# Altium schematic sheet SERIAL_INTERFACES.SchDoc: Carte mère embarquée - RS232 interface
size A3; Author: B Labbe; CompanyName: Oufffteam; DrawnBy: B Labbe; Engineer: B Labbe; Organization: Oufffteam; Address1: L3, 12a Rodborough Rd; Address2: Frenchs Forest; Address3: NSW; Address4: Australia 2086; Revision: A; SheetNumber: 6; SheetTotal: 6; DocumentName: Carte mère embarquée - RS232 interface
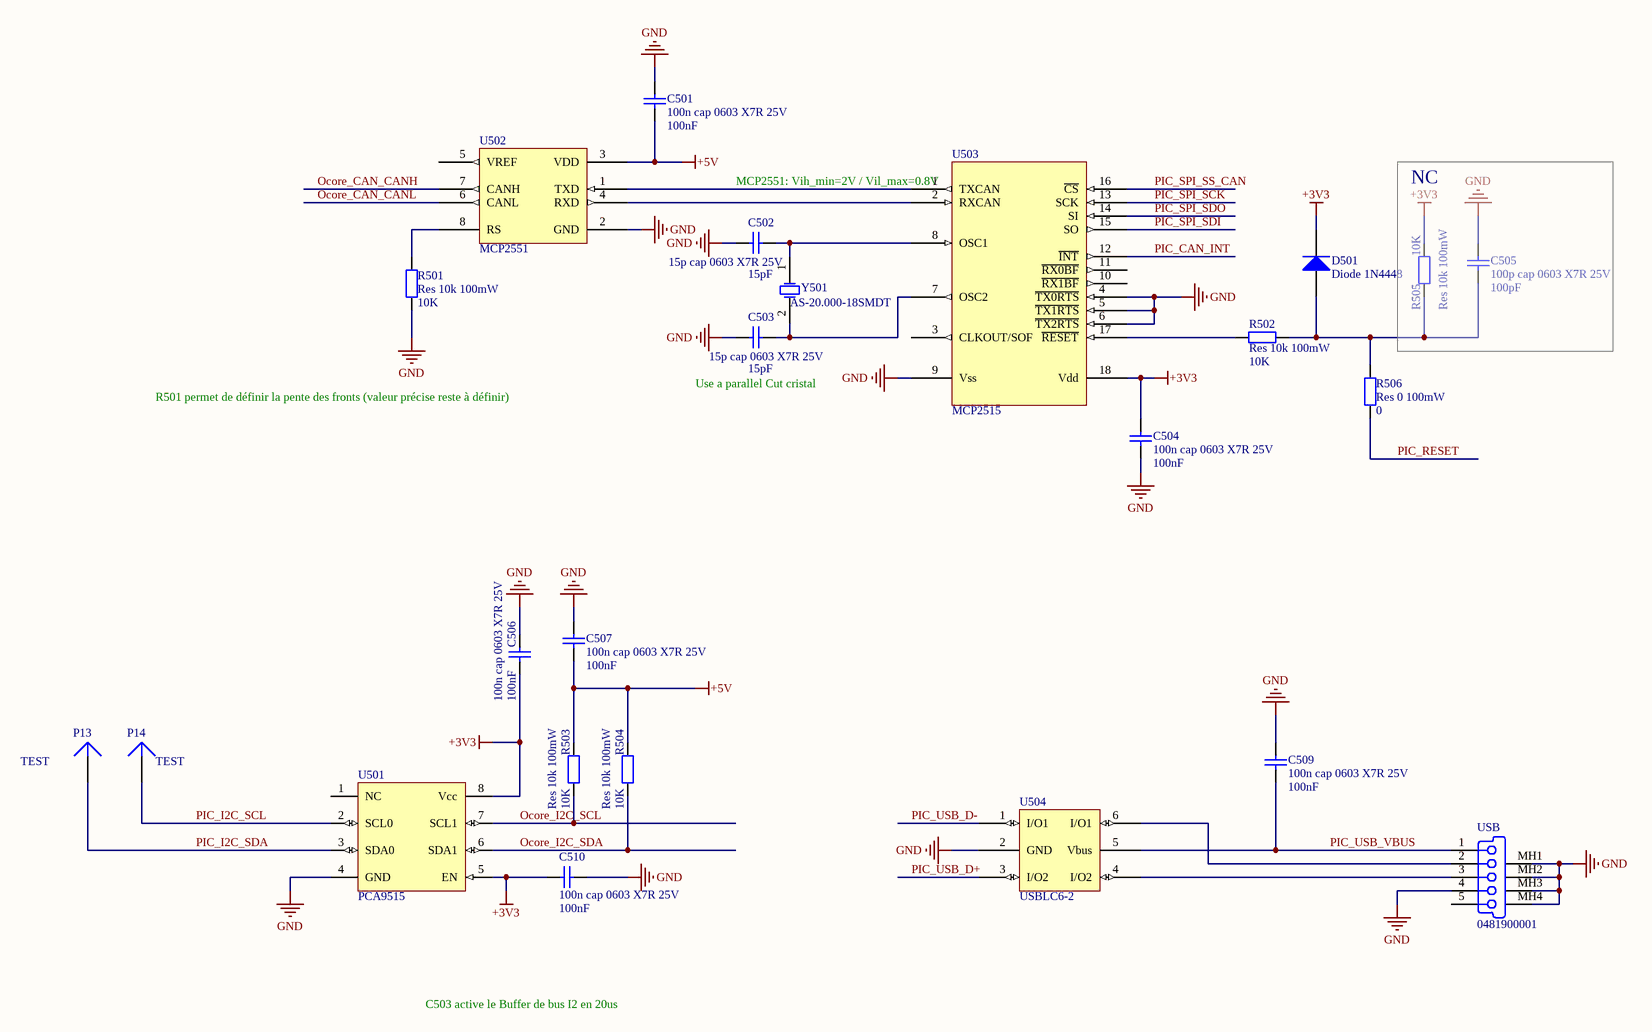
[diagram p0: SERIAL_INTERFACES.SchDoc]

## Parts
C501  100n cap 0603 X7R 25V  value 100nF  [1608[0603]]
C502  15p cap 0603 X7R 25V  value 15pF  [1608[0603]]
C503  15p cap 0603 X7R 25V  value 15pF  [1608[0603]]
C504  100n cap 0603 X7R 25V  value 100nF  [1608[0603]]
C505  100p cap 0603 X7R 25V  value 100pF  [1608[0603]]
C506  100n cap 0603 X7R 25V  value 100nF  [1608[0603]]
C507  100n cap 0603 X7R 25V  value 100nF  [1608[0603]]
C509  100n cap 0603 X7R 25V  value 100nF  [1608[0603]]
C510  100n cap 0603 X7R 25V  value 100nF  [1608[0603]]
D501  Diode 1N4448  [1608[0603]]
P13  TEST  [TP1]
P14  TEST  [TP1]
R501  Res 10k 100mW  value 10K  [1608[0603]]
R502  Res 10k 100mW  value 10K  [1608[0603]]
R503  Res 10k 100mW  value 10K  [1608[0603]]
R504  Res 10k 100mW  value 10K  [1608[0603]]
R505  Res 10k 100mW  value 10K  [1608[0603]]
R506  Res 0 100mW  value 0  [1608[0603]]
U501  PCA9515  [751-02_M]
U502  MCP2551  [SOIC150-8_N]
U503  MCP2515  [SOIC127P1030X265-18N]
U504  USBLC6-2  [SOT23-6]
USB  0481900001  [USB]
Y501  AS-20.000-18SMDT  [HC49/S]

## Blocks framed on the sheet
NC: C505 R505

## Nets
+3V3: C504.1 C506.1 C510.2 D501.2(K) R505.2 U501.5(EN) U501.8(Vcc) U503.18(Vdd)
+5V: C501.1 C507.2 R503.2 R504.2 U502.3(VDD)
GND: C501.2 C502.1 C503.1 C504.2 C505.2 C506.2 C507.1 C509.2 C510.1 R501.1 U501.4(GND) U502.2(GND) U503.4(~{TX0RTS}) U503.5(~{TX1RTS}) U503.6(~{TX2RTS}) U503.9(Vss) U504.2(GND) USB.4(NC) USB.MH1(Tab) USB.MH2(Tab) USB.MH3(Tab) USB.MH4(Tab)
Ocore_CAN_CANH: U502.7(CANH)
Ocore_CAN_CANL: U502.6(CANL)
Ocore_I2C_SCL: R503.1 U501.7(SCL1)
Ocore_I2C_SDA: R504.1 U501.6(SDA1)
PIC_CAN_INT: U503.12(~{INT})
PIC_I2C_SCL: P14.1 U501.2(SCL0)
PIC_I2C_SDA: P13.1 U501.3(SDA0)
PIC_RESET: R506.1
PIC_SPI_SCK: U503.13(SCK)
PIC_SPI_SDI: U503.15(SO)
PIC_SPI_SDO: U503.14(SI)
PIC_SPI_SS_CAN: U503.16(~{CS})
PIC_USB_D+: U504.3(I/O2)
PIC_USB_D-: U504.1(I/O1)
PIC_USB_VBUS: C509.1 U504.5(Vbus) USB.1(V_BUS_(5V))
NetC502_2: C502.2 U503.8(OSC1) Y501.1(OSC1)
NetC503_2: C503.2 U503.7(OSC2) Y501.2(OSC2)
NetC505_1: C505.1 D501.1(A) R502.2 R505.1 R506.2
NetR501_2: R501.2 U502.8(RS)
NetR502_1: R502.1 U503.17(~{RESET})
NetU502_1: U502.1(TXD) U503.1(TXCAN)
NetU502_4: U502.4(RXD) U503.2(RXCAN)
NetU504_4: U504.4(I/O2) USB.3(D+)
NetU504_6: U504.6(I/O1) USB.2(D-)

Not connected (* = marked no-connect by the designer): U501 1(NC); U502 5(VREF); U503 3(CLKOUT/SOF) 10(~{RX1BF}) 11(~{RX0BF}); USB 5(GND)

## Notes on the sheet
- (near U503) MCP2551: Vih_min=2V / Vil_max=0.8V
- R501 permet de définir la pente des fronts (valeur précise reste à définir)
- (near C503) Use a parallel Cut cristal
- C503 active le Buffer de bus I2 en 20us
- Title
- Size:
- Date:
- A3
- Number:
- Time:
- Revision:
- Sheet
- of
- Oufffteam
- 3 place Carnot
- 26100
- Romans sur Isère
- oufffteam@gmail.com
- File:

## Library data of the parts
C501-C507 C509 C510 = Cap: Capacitor; Published: 8-Jun-2000; LatestRevisionDate: 17-Jul-2002; LatestRevisionNote: Re-released for DXP Platform.; PackageReference: RAD-0.3; Publisher: Altium Limited
D501 = Diode 1N4448: High Conductance Fast Diode 0603 case; Published: 8-Jun-2000; LatestRevisionDate: 17-Jul-2002; LatestRevisionNote: Re-released for DXP Platform.; DatasheetDocument: 1997; PackageReference: DO-35; Publisher: Altium Limited; Code_JEDEC: DO-204-AH; ComponentLink1Description: Manufacturer Link; ComponentLink1URL: http://www.fairchildsemi.com/; ComponentLink2Description: Datasheet; ComponentLink2URL: http://www.fairchildsemi.com/ds/1N%2F1N4448.pdf
P13 P14 = Plug: LatestRevisionDate: 17-Jul-2002; LatestRevisionNote: Re-released for DXP Platform.; Publisher: Altium Limited
R501-R506 = Res2: Resistor; Published: 8-Jun-2000; LatestRevisionDate: 17-Jul-2002; LatestRevisionNote: Re-released for DXP Platform.; PackageReference: AXIAL-0.4; Publisher: Altium Limited
U501 = PCA9515: I2C bus repeater
U502 = MCP2551: High Speed Can Transceiver; Published: 6-Oct-2005; LatestRevisionDate: 13-Apr-2006; LatestRevisionNote: IPC-7351 Footprint Added.; DatasheetVersion: Nov-2003; PackageVersion: Oct-2005; PackageReference: SOIC150-8; Publisher: Altium Limited; PackageDescription: 8-Pin Plastic Narrow Body Small Outline Integrated Circuit 1.27 mm Pitch; Code_JEDEC: MS-012; ComponentLink1Description: Manufacturer Link; ComponentLink1URL: http://www.microchip.com; ComponentLink2Description: Datasheet; ComponentLink2URL: http://ww1.microchip.com/downloads/en/DeviceDoc/21667d.pdf
U503 = MCP2515: Stand Alone CAN Controller With SPI Interface
U504 = USBLC6-2: Very low capacitance ESD protection
USB = 0481900001: USB On-The-Go (OTG) Mini-B Receptacle, Right Angle, SMT, 0.80mm (.031") Pitch, Solder Tabs with Back Cover, Recessed Type; PCB_Layout: Complies with Manufacturer's Recommendation.; Published: 21-Sep-2007; DatasheetVersion: revA, May-2004; PackageVersion: May-2004; PackageReference: 481900001; Publisher: Altium Limited; PackageDescription: USB Mini-B, Sinking Type, SM; 5 Position; Right Angle, Body 11.45 x 11.8 x 3.9 mm (LxWxH); ComponentLink1Description: Manufacturer Link; ComponentLink1URL: http://www.molex.com/; ComponentLink2Description: Datasheet; ComponentLink2URL: http://www.molex.com/cmc_upload/0/000/895/958/SD-48190-001RevA.pdf
Y501 = XTAL: Crystal Oscillator; Published: 8-Jun-2000; LatestRevisionDate: 17-Jul-2002; LatestRevisionNote: Re-released for DXP Platform.; PackageReference: R38; Publisher: Altium Limited